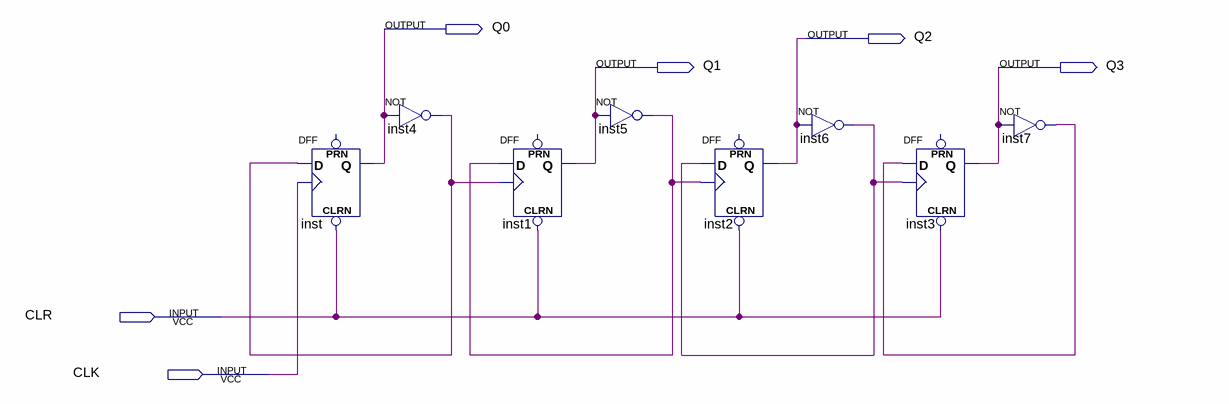
[diagram p0: schematic sheet]
// Quartus schematic yi.bdf as structural Verilog: 8 symbols, 6 pins
module yi (
  input  CLR,
  input  CLK,
  output Q0,
  output Q2,
  output Q1,
  output Q3
);

  wire inst4_out, inst5_out, inst6_out, inst7_out;

  DFF inst (.CLRN(CLR), .CLK(CLK), .D(inst4_out), .Q(Q0));  // open: PRN
  not inst4 (inst4_out, Q0);
  DFF inst1 (.CLRN(CLR), .CLK(inst4_out), .D(inst5_out), .Q(Q1));  // open: PRN
  not inst5 (inst5_out, Q1);
  DFF inst2 (.CLRN(CLR), .CLK(inst5_out), .D(inst6_out), .Q(Q2));  // open: PRN
  not inst6 (inst6_out, Q2);
  DFF inst3 (.CLRN(CLR), .CLK(inst6_out), .D(inst7_out), .Q(Q3));  // open: PRN
  not inst7 (inst7_out, Q3);
endmodule
